# Altium schematic sheet HEALTH_MAX86150.SchDoc
size A; SheetNumber: 3
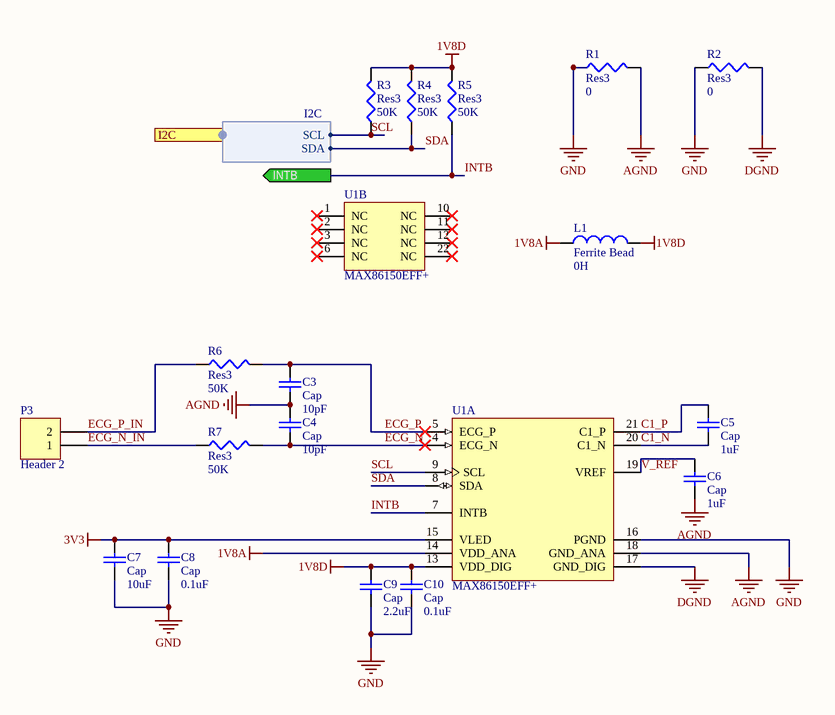
[diagram p0: HEALTH_MAX86150.SchDoc]

## Parts
C3  Cap  value 10pF  [CAPC1005N]
C4  Cap  value 10pF  [CAPC1005N]
C5  Cap  value 1uF  [CAPC1005N]
C6  Cap  value 1uF  [CAPC1005N]
C7  Cap  value 10uF  [CAPC2012N]
C8  Cap  value 0.1uF  [CAPC1005N]
C9  Cap  value 2.2uF  [CAPC1005N]
C10  Cap  value 0.1uF  [CAPC1005N]
L1  Ferrite Bead  value 0H  [INDC1005N]
P3  Header 2  [HDR1X2-PINS]
R1  Res3  value 0  [RESC1005N]
R2  Res3  value 0  [RESC1005N]
R3  Res3  value 50K  [RESC1005N]
R4  Res3  value 50K  [RESC1005N]
R5  Res3  value 50K  [RESC1005N]
R6  Res3  value 50K  [RESC1005N]
R7  Res3  value 50K  [RESC1005N]
U1  MAX86150EFF+  [MAXM-OESIP-22_V]  (parts A,B of 2)

## Ports
I2C (harness I2C), INTB (out)

## Harnesses
I2C: SCL, SDA

## Nets
1V8A: L1.1 U1.14(VDD_ANA)
1V8D: C9.2 C10.2 L1.2 R3.2 R4.2 R5.2 U1.13(VDD_DIG)
3V3: C7.2 C8.2 U1.15(VLED)
AGND: C3.1 C4.2 C6.1 R1.2 U1.18(GND_ANA)
DGND: R2.2 U1.17(GND_DIG)
GND: C7.1 C8.1 C9.1 C10.1 R1.1 R2.1 U1.16(PGND)
C1_N: C5.1 U1.20(C1_N)
C1_P: C5.2 U1.21(C1_P)
ECG_N: C4.1 R7.2 U1.4(ECG_N)
ECG_N_IN: P3.1 R7.1
ECG_P: C3.2 R6.2 U1.5(ECG_P)
ECG_P_IN: P3.2 R6.1
INTB: R5.1 U1.7(INTB) ; port INTB
SCL: R3.1 U1.9(SCL) ; port I2C.SCL
SDA: R4.1 U1.8(SDA) ; port I2C.SDA
V_REF: C6.2 U1.19(VREF)

Not connected (* = marked no-connect by the designer): U1 1(NC)* 2(NC)* 3(NC)* 6(NC)* 10(NC)* 11(NC)* 12(NC)* 22(NC)*

## Library data of the parts
C3-C10 = Cap: Capacitor; Published: 8-Jun-2000; LatestRevisionDate: 17-Jul-2002; LatestRevisionNote: Re-released for DXP Platform.; PackageReference: RAD-0.3; Publisher: Altium Limited; PackageDescription: Radial Cap, Thru-Hole; 2 Leads; 0.3 in Pin Spacing
L1 = Inductor: Code_IEC: 1005; Published: 8-Jun-2000; LatestRevisionDate: 29-May-2009; LatestRevisionNote: IPC-7351 Footprint Added.; PackageReference: 0402-A; Publisher: Altium Limited; PackageDescription: Chip Inductor; Code_JEITA: 0402
P3 = Header 2: Header, 2-Pin; LatestRevisionDate: 17-Jul-2002; LatestRevisionNote: Re-released for DXP Platform.; Publisher: Altium Limited
R1-R7 = Res3: Resistor; Published: 8-Jun-2000; LatestRevisionDate: 29-May-2009; LatestRevisionNote: IPC-7351 Footprint Added.; PackageReference: J1-0603; Publisher: Altium Limited; PackageDescription: Chip Resistor
U1 = CMP-2000-07578-1: Integrated Photoplethysmogram and Electrocardiogram Bio-Sensor Module for Mobile Health, 1.7 to 2 V, -40 to 85 degC, 22-Pin OESIP, RoHS; Manufacturer: Maxim; Package Description: 22-Pin Surface Mount Device, Body 3.3 x 5.6 mm; Manufacturer URL: http://www.maximintegrated.com/; Mounting Technology: SurfaceMount; Datasheet Version: Rev. 1, 11/2016; Package Reference: OESIP-22; Datasheet URL: http://www.mouser.com/ds/2/256/Maxim-6-13-2017-MAX86150%20DS-1114324.pdf